# EAGLE design LowduinoSMD_v2 (EAGLE 7.2.0)
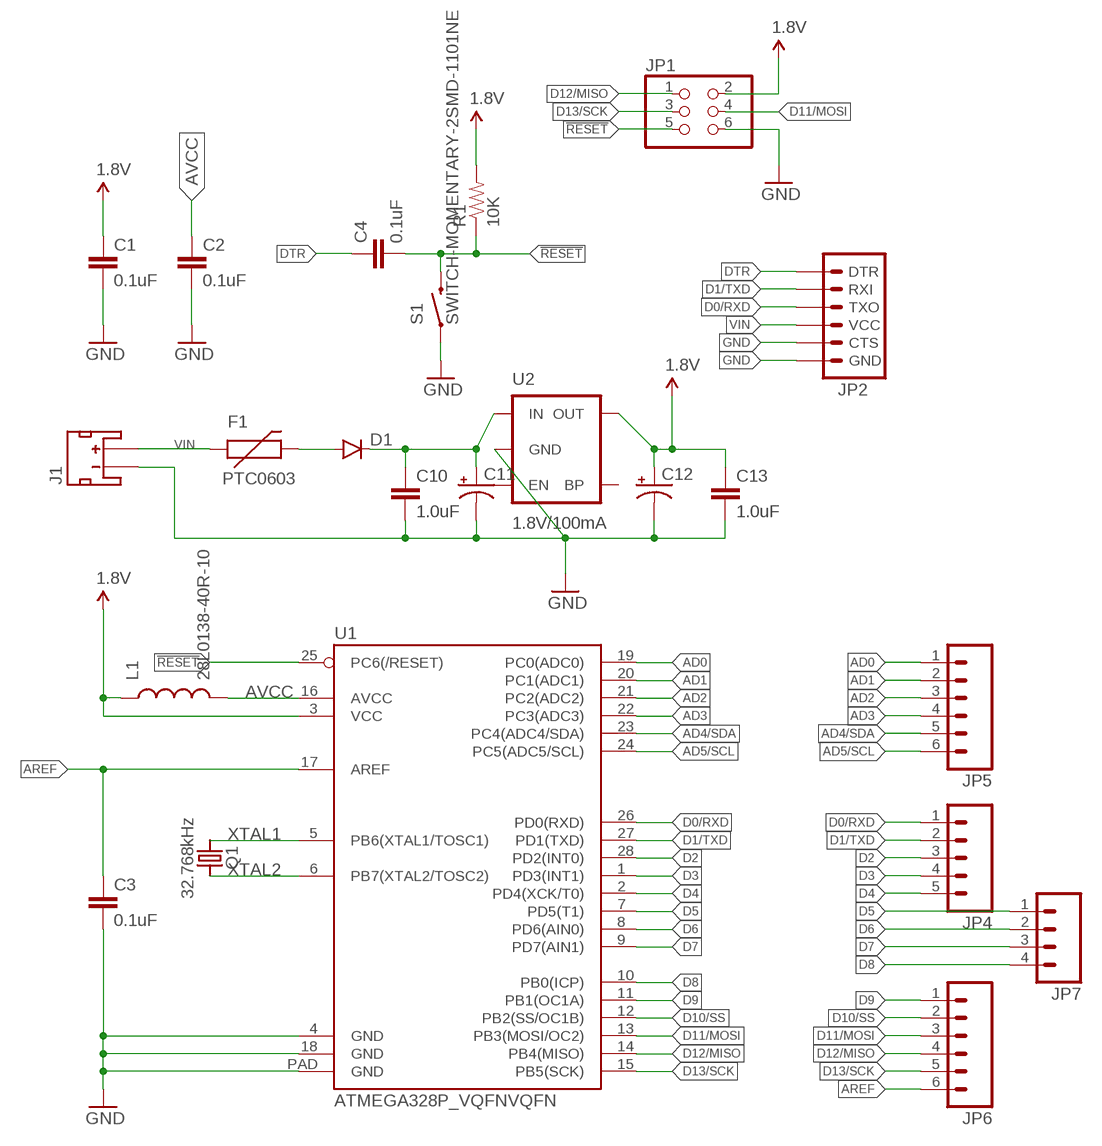
[diagram p0: schematic, sheet 1]

## Parts
C1  0.1uF  0.1UF-16V(+-10%)(0402)  [0402-CAP]
C2  0.1uF  0.1UF-16V(+-10%)(0402)  [0402-CAP]
C3  0.1uF  0.1UF-16V(+-10%)(0402)  [0402-CAP]
C4  0.1uF  0.1UF-16V(+-10%)(0402)  [0402-CAP]
C10  1.0uF  1.0UF-16V-10%(0402)  [0402-CAP]
C11  CAP_POLC  [PANASONIC_C]
C12  CAP_POLC  [PANASONIC_C]
C13  1.0uF  1.0UF-16V-10%(0402)  [0402-CAP]
D1  DIODESOD523  [SOD523]
F1  PTC0603  [0603]
J1  JST_2MM_MALE  [JST-2-SMD]
JP1  PINHD-2X3  [2X03]
JP2  ARDUINO_SERIAL_PROGRAMPTH  [1X06]
JP4  M05NO_SILK  [1X05_NO_SILK]
JP5  M06NO_SILK_FEMALE_PTH  [1X06_NO_SILK]
JP6  M06NO_SILK_FEMALE_PTH  [1X06_NO_SILK]
JP7  M04NO_SILK_ALL_ROUND  [1X04_NO_SILK_ALL_ROUND]
L1  28L0138-40R-10  INDUCTOR0402  [C0402]
Q1  32.768kHz  FX12232.768KHZ  [2-SMD]
R1  10K  RESISTOR0402  [0402-RES]
S1  SWITCH-MOMENTARY-2SMD-1101NE  [TACTILE-SWITCH-1101NE]
U1  ATMEGA328P_VQFNVQFN  [VQFN-28]
U2  1.8V/100mA  V_REG_SP62141.8V  [SC70]

## Nets
1.8V: C1.1 C12.+ C13.1 JP1.2 L1.1 R1.2 U1.3(VCC) U2.5(OUT)
!RESET: C4.2 JP1.5 R1.1 S1.2 U1.25(PC6(/RESET))
AD0: JP5.1 U1.19(PC0(ADC0))
AD1: JP5.2 U1.20(PC1(ADC1))
AD2: JP5.3 U1.21(PC2(ADC2))
AD3: JP5.4 U1.22(PC3(ADC3))
AD4/SDA: JP5.5 U1.23(PC4(ADC4/SDA))
AD5/SCL: JP5.6 U1.24(PC5(ADC5/SCL))
AREF: C3.1 JP6.6 U1.17(AREF)
AVCC: C2.1 L1.2 U1.16(AVCC)
D0/RXD: JP2.3(TXO) JP4.1 U1.26(PD0(RXD))
D1/TXD: JP2.2(RXI) JP4.2 U1.27(PD1(TXD))
D2: JP4.3 U1.28(PD2(INT0))
D3: JP4.4 U1.1(PD3(INT1))
D4: JP4.5 U1.2(PD4(XCK/T0))
D5: JP7.1 U1.7(PD5(T1))
D6: JP7.2 U1.8(PD6(AIN0))
D7: JP7.3 U1.9(PD7(AIN1))
D8: JP7.4 U1.10(PB0(ICP))
D9: JP6.1 U1.11(PB1(OC1A))
D10/SS: JP6.2 U1.12(PB2(SS/OC1B))
D11/MOSI: JP1.4 JP6.3 U1.13(PB3(MOSI/OC2))
D12/MISO: JP1.1 JP6.4 U1.14(PB4(MISO))
D13/SCK: JP1.3 JP6.5 U1.15(PB5(SCK))
DTR: C4.1 JP2.1(DTR)
GND: C1.2 C2.2 C3.2 C10.2 C11.- C12.- C13.2 J1.1(-) JP1.6 JP2.5(CTS) JP2.6(GND) S1.1 U1.4(GND) U1.18(GND) U1.PAD(GND) U2.2(GND)
N$3: D1.A F1.2
N$7: C10.1 C11.+ D1.C U2.1(IN)
VIN: F1.1 J1.2(+) JP2.4(VCC)
XTAL1: Q1.1 U1.5(PB6(XTAL1/TOSC1))
XTAL2: Q1.2 U1.6(PB7(XTAL2/TOSC2))
Unconnected: J1.NC1(PAD1) J1.NC2(PAD2) U2.3(EN) U2.4(BP)

## Library data of the parts
C1-C4 = SparkFun-Capacitors:0.1UF-16V(+-10%)(0402); PROD_ID: CAP-12416
C10 C13 = SparkFun-Capacitors:1.0UF-16V-10%(0402); PROD_ID: CAP-12417
C11 C12 = SparkFun-Capacitors:CAP_POL: Capacitor Polarized These are standard SMD and PTH capacitors. Normally 10uF, 47uF, and 100uF in electrolytic and tantalum varieties. Always verify the external diameter of the through hole cap, it varies with capacity, voltage, and manufacturer. The EIA devices should be standard.
D1 = SparkFun-DiscreteSemi:DIODE: Diode These are standard reverse protection diodes and small signal diodes. SMA package can handle up to about 1A. SOD-323 can handle about 200mA. What the SOD-323 package when ordering, there are some mfgs out there that are 5-pin packages.
F1 = SparkFun-PowerIC:PTC: Resettable Fuse PTC Resettable Fuse. Spark Fun Electronics SKU : COM-08357
J1 = SparkFun-Connectors:JST_2MM_MALE: Mates to single-cell LiPo batteries. CONN-08352; PROD_ID: CONN-08352
JP1 = pinhead:PINHD-2X3: PIN HEADER
JP2 = SparkFun-Connectors:ARDUINO_SERIAL_PROGRAM: FTDI connector footprints
JP4 = SparkFun-Connectors:M05: Header 5 Standard 5-pin 0.1" header. Use with straight break away headers (SKU : PRT-00116), right angle break away headers (PRT-00553), swiss pins (PRT-00743), machine pins (PRT-00117), and female headers (PRT-00115). Molex polarized connector foot print use with SKU : PRT-08230 with associated crimp pins and housings.
JP5 JP6 = SparkFun-Connectors:M06: Header 6 Standard 6-pin 0.1" header. Use with straight break away headers (SKU : PRT-00116), right angle break away headers (PRT-00553), swiss pins (PRT-00743), machine pins (PRT-00117), and female headers (PRT-00115). Molex polarized connector foot print use with SKU : PRT-08094 with associated crimp pins and housings. NOTES ON THE VARIANTS LOCK and LOCK_LONGPADS... This footprint was designed to help hold the alignment of a through-hole component (i.e. 6-pin header) while soldering it into place. You may notice that each hole has been shifted either up or down by 0.005 of an inch from it's more standard position (which is a perfectly straight line). This slight alteration caused the pins (the squares in the middle) to touch the edges of the holes. Because they are alternating, it causes a "brace" to hold the component in place. 0.005 has proven to be the perfect amount of "off-center" position when using our standard breakaway headers. Although looks a little odd when you look at the bare footprint, once you have a header in there, the alteration is very hard to notice. Also,if you push a header all the way into place, it is covered up entirely on the bottom side. This idea of altering the position of holes to aid alignment will be further integrated into the Sparkfun Library for other footprints. It can help hold any component with 3 or more connection pins.; PROD_ID: CONN-08437
JP7 = SparkFun-Connectors:M04: Header 4 Standard 4-pin 0.1" header. Use with straight break away headers (SKU : PRT-00116), right angle break away headers (PRT-00553), swiss pins (PRT-00743), machine pins (PRT-00117), and female headers (PRT-00115). Molex polarized connector foot print use with SKU : PRT-08231 with associated crimp pins and housings. 1MM SMD Version SKU: PRT-10208
L1 = SparkFun-Passives:INDUCTOR: Inductors Basic Inductor/Choke - 0603 and 1206. Footprints are not proven and vary greatly between part numbers. SRN6045- 33uH, 20% 1.4A SDR0403-560KL - 56uH, 10%, 500mA RMS/740mA peak
Q1 = fx122:FX122: FX122 - SMD 2.0 x 1.2 Tuning Fork Crystal Technical Specifications: Frequency: 32.768 kHz Frequency Tolerance @ 25ºC: ±20 PPM Frequency Stability Temperature Coefficient: -0.04 PPM / (ΔºC)^2 0.6mm Height Long Term Stability http://www.foxonline.com/pdfs/FX122.pdf; DIGIKEY: 631-1261-1-ND
R1 = SparkFun-Resistors:RESISTOR: Resistor Basic schematic elements and footprints for 0603, 1206, and PTH resistors.
S1 = SparkFun-Electromechanical:SWITCH-MOMENTARY-2: Various NO switches- pushbuttons, reed, etc; PROD_ID: SWCH-00815
U1 = SparkFun-DigitalIC:ATMEGA328P_VQFN
U2 = SparkFun-PowerIC:V_REG_SP6214; PROD_ID: VREG-08428

## Board
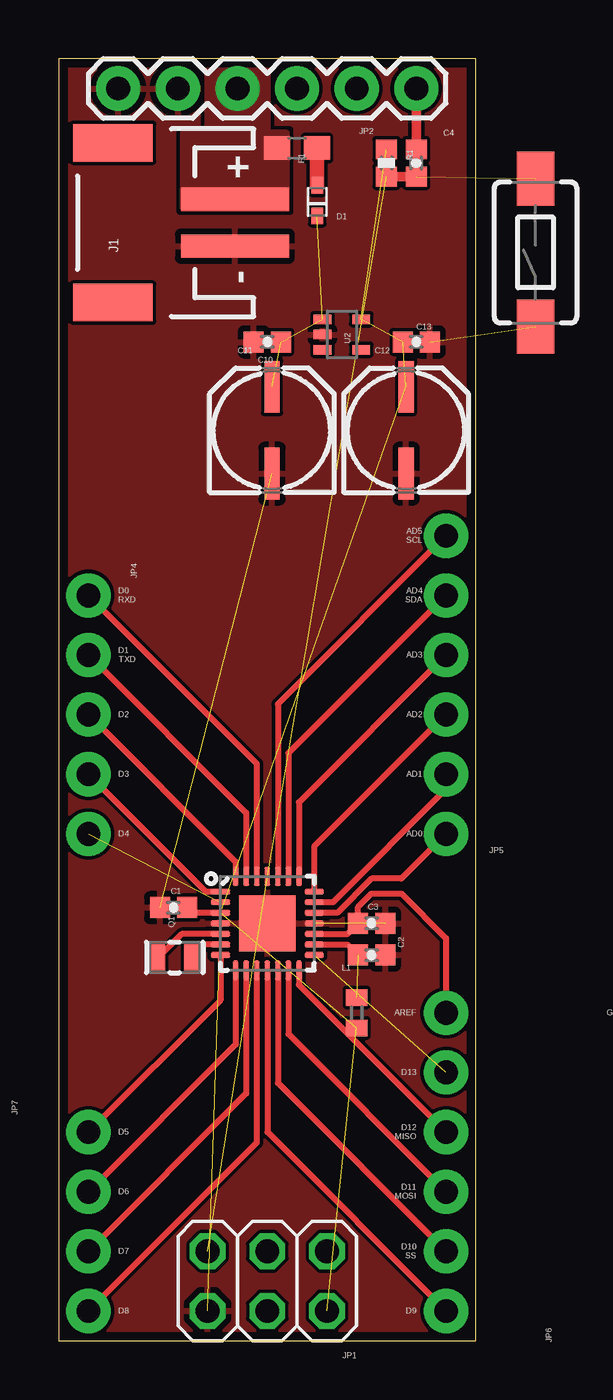
[diagram p1: board, top side]
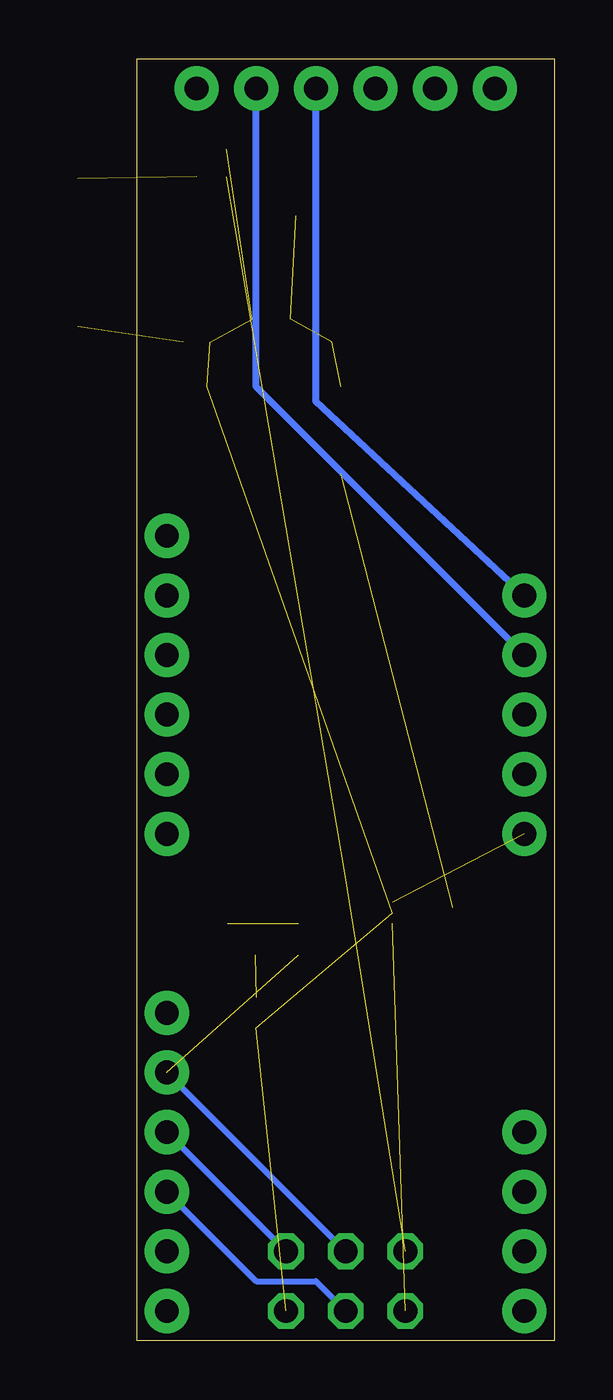
[diagram p2: board, bottom side, seen from below]

Size 17.78 x 54.61 mm. Coordinates in mm from the lower left corner, seen from the top.
Outline: 17.78,54.61 0,54.61 0,0 17.78,0 17.78,54.61
Copper layers (1*16): Top 0.0356mm / dielectric 1.5011mm / Bottom 0.0356mm
Design rules "oshpark-2layer": minimum track width 6mil, minimum drill 13mil, track to track 6mil, track to pad 6mil, pad to pad 6mil, via to via 6mil, smd to smd 6mil, copper to edge 15mil, drill to drill 6mil, minimum pad ring 7mil, minimum via ring 7mil, stop-mask expansion 4mil, vias tented up to drill 0mil, thermal gap 10mil

### Footprints (pad centres in the part's own frame; a part is rotated, then mirrored left to right if it is on the bottom)
0402-CAP = smd 0.85 x 0.9: 1 -0.58,0; 2 0.58,0
PANASONIC_C = smd 2.2 x 0.65: + 1.9,-0.2; - -1.8,-0.2
SOD523 = smd 0.7 x 0.5: A 0.7,0; C -0.6,0
0603 = smd 1.1 x 1: 1 -0.85,0; 2 0.85,0
JST-2-SMD = smd 1 x 4.6: 1 -1,-3.7; 2 1,-3.7 | smd 1.6 x 3.4: NC1 -3.4,1.5; NC2 3.4,1.5
2X03 = drill 1.016 octagon: 1 -2.54,-1.27; 2 -2.54,1.27; 3 0,-1.27; 4 0,1.27; 5 2.54,-1.27; 6 2.54,1.27
1X06 = drill 1.016 pad 1.88: 1 0,0; 2 2.54,0; 3 5.08,0; 4 7.62,0; 5 10.16,0; 6 12.7,0
1X05_NO_SILK = drill 1.016 pad 1.88: 1 0,0; 2 2.54,0; 3 5.08,0; 4 7.62,0; 5 10.16,0
1X06_NO_SILK = drill 1.016 pad 1.88: 1 0,0; 2 2.54,0; 3 5.08,0; 4 7.62,0; 5 10.16,0; 6 12.7,0
1X04_NO_SILK_ALL_ROUND = drill 1.016 pad 1.88: 1 0,0; 2 2.54,0; 3 5.08,0; 4 7.62,0
C0402 = smd 0.7 x 0.9: 1 -0.65,0; 2 0.65,0
2-SMD = smd 0.6 x 1.1: 1 -0.7,0; 2 0.7,0
0402-RES = smd 0.85 x 0.9: 1 -0.58,0; 2 0.58,0
TACTILE-SWITCH-1101NE = smd 2.3 x 1.6: 1 -3.15,0; 2 3.15,0
VQFN-28 = smd 0.82 x 0.24: 1 -2,1.35; 2 -2,0.9; 3 -2,0.45; 4 -2,0; 5 -2,-0.45; 6 -2,-0.9; 7 -2,-1.35; 15 2,-1.35; 16 2,-0.9; 17 2,-0.45; 18 2,0; 19 2,0.45; 20 2,0.9; 21 2,1.35 | smd 0.24 x 0.82: 8 -1.35,-2; 9 -0.9,-2; 10 -0.45,-2; 11 0,-2; 12 0.45,-2; 13 0.9,-2; 14 1.35,-2; 22 1.35,2; 23 0.9,2; 24 0.45,2; 25 0,2; 26 -0.45,2; 27 -0.9,2; 28 -1.35,2 | smd 2.4 x 2.4: PAD 0,0
SC70 = smd 0.4 x 0.75: 1 -0.65,-0.825; 2 0,-0.825; 3 0.65,-0.825; 4 0.65,0.825; 5 -0.65,0.825

### Placement (x,y rotation side)
C1  4.89,18.45 180 top
C2  13.34,16.43 0 top
C3  13.34,17.78 0 top
C4  15.24,50.16 270 top
C10  8.89,42.55 180 top
C11  8.89,38.73 90 top
C12  14.61,38.73 90 top
C13  15.24,42.55 0 top
D1  11.02,48.51 90 top
F1  10.16,50.8 0 top
J1  3.81,47.62 90 top
JP1  8.89,2.54 180 top
JP2  15.24,53.34 180 top
JP4  1.27,31.75 270 top
JP5  16.51,21.59 90 top
JP6  16.51,1.27 90 top
JP7  1.27,8.89 270 top
L1  12.7,13.97 90 top
Q1  4.95,16.33 0 top
R1  13.97,50.16 90 top
S1  20.32,46.35 90 top
U1  8.89,17.78 0 top
U2  12.06,42.86 270 top

### Tracks (layer width: path | path; a pad name or v marks a point on that pad's centre or on a via)
1.8V  (6 unrouted)
  Top 0.254: U1.3 5.7,18.23 C1.1
!RESET  (3 unrouted)
  Top 0.406: R1.1 C4.2
AD0
  Top 0.254: JP5.1 14.61,19.68 13.34,19.68 11.88,18.23 U1.19
AD1
  Top 0.254: JP5.2 16.51,23.5 11.7,18.68 U1.20
AD2
  Top 0.254: JP5.3 10.89,21.05 U1.21
AD3
  Top 0.254: JP5.4 10.24,22.94 U1.22
AD4/SDA
  Top 0.254: JP5.5 9.79,25.03 U1.23
AD5/SCL
  Top 0.254: JP5.6 9.34,27.12 U1.24
AREF
  Top 0.254: U1.17 12.3,17.33 C3.1 12.76,18.47 13.34,19.05 14.61,19.05 16.51,17.14 JP6.6
AVCC  (1 unrouted)
  Top 0.254: U1.16 12.3,16.88 C2.1
D0/RXD
  Top 0.254: JP4.1 8.44,24.58 U1.26
  Bottom 0.305: JP4.1 10.16,40.01 JP2.3
D1/TXD
  Top 0.254: JP4.2 7.99,22.49 U1.27
  Bottom 0.305: JP4.2 12.7,40.64 JP2.2
D2
  Top 0.254: JP4.3 7.54,20.4 U1.28
D3
  Top 0.254: JP4.4 6.27,19.13 U1.1
D4  (1 unrouted)
D5
  Top 0.254: U1.7 6.89,14.51 JP7.1
D6
  Top 0.254: U1.8 7.54,12.62 JP7.2
D7
  Top 0.254: U1.9 7.99,10.53 JP7.3
D8
  Top 0.254: U1.10 8.44,8.44 JP7.4
D9
  Top 0.254: U1.11 8.89,8.89 JP6.1
D10/SS
  Top 0.254: U1.12 9.34,10.98 JP6.2
D11/MOSI
  Top 0.254: U1.13 9.79,13.07 JP6.3
  Bottom 0.254: JP6.3 12.7,2.54 10.16,2.54 JP1.4
D12/MISO
  Top 0.254: U1.14 10.24,15.16 JP6.4
  Bottom 0.254: JP6.4 JP1.1
D13/SCK  (1 unrouted)
  Bottom 0.254: JP6.5 JP1.3
DTR
  Top 0.406: C4.1 JP2.1
GND  (4 unrouted)
  pour Top (rank 2): 17.78,54.61 0,54.61 0,0 17.78,0
N$3
  Top 0.406: F1.2
  Top 0.61: F1.2 D1.A
N$7  (3 unrouted)
VIN
  pour Top (no thermals): 6.35,54.61 6.35,51.44 5.3,51.44 5.3,48.26 9.71,48.26 9.71,51.44 8.89,51.44 8.89,54.61
XTAL1
  Top 0.254: U1.5 5.25,17.33 Q1.1
XTAL2
  Top 0.254: U1.6 6.2,16.88 Q1.2

### Text on the board
tNames: AD5 / SCL | D0 / RXD | AD4 / SDA | D1 / TXD | AD3 | D2 | AD2 | D3 | AD1 | D4 | AD0 | AREF | GND | D13 | D5 | D12 / MISO | D6 | D11 / MOSI | D7 | D10 / SS | D8 | D9